# EAGLE design LPC_4TE_3.7_smd (EAGLE 5.03)
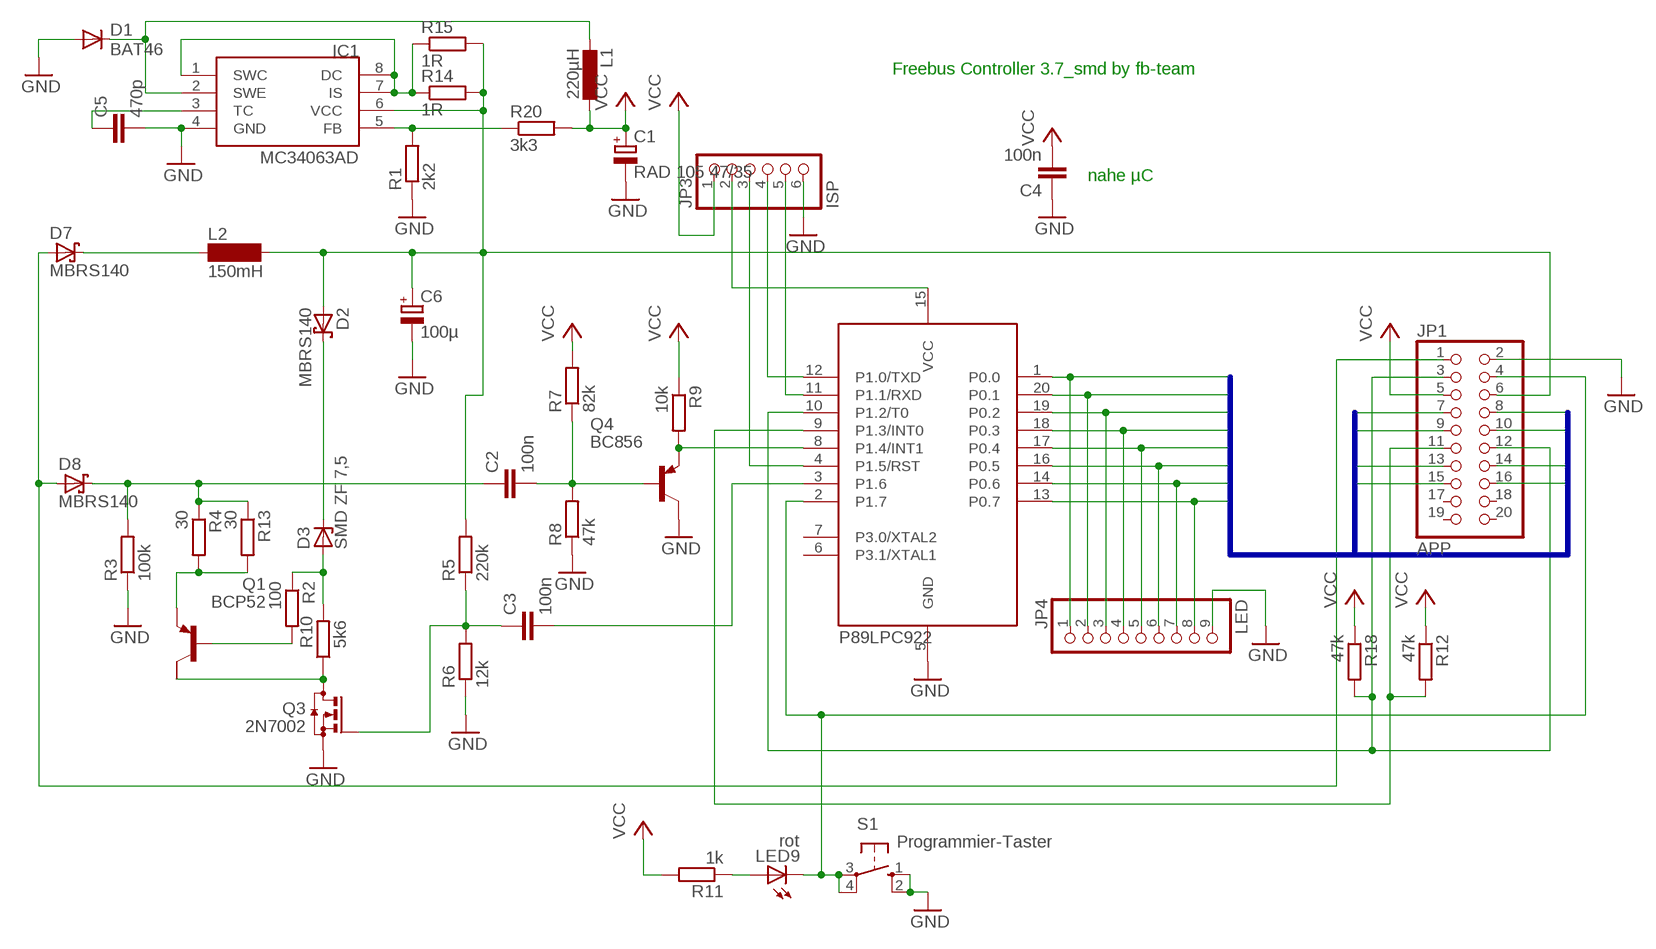
[diagram p0: schematic, sheet 1]

## Parts
C1  RAD 105 47/35  CPOL-EUE2-5  [E2-5]
C2  100n  C-EUC1206  [C1206]
C3  100n  C-EUC1206  [C1206]
C4  100n  C-EUC1206  [C1206]
C5  470p  C-EUC1206  [C1206]
C6  100µ  CPOL-EUE2.5-7  [E2,5-7]
D1  BAT46  DIODE-MINIMELF  [MINIMELF]
D2  MBRS140  MBRS130LT3  [SMB]
D3  SMD ZF 7,5  ZPD  [MINIMELF]
D7  MBRS140  MBRS130LT3  [SMB]
D8  MBRS140  MBRS130LT3  [SMB]
IC1  MC34063AD  [SOIC8]
JP1  APP  PINHD-2X10  [2X10]
JP3  ISP  PINHD-1X6  [1X06]
JP4  LED  PINHD-1X9  [1X09]
L1  220µH  L-EU2200-11.43  [2200-11.43]
L2  150mH  SD12-1000  [SD12_1000]
LED9  rot  LED3MM  [LED3MM]
Q1  BCP52  FZT753SMD  [SOT223]
Q3  2N7002  BSS123  [SOT23]
Q4  BC856  BC856ALT1SMD  [SOT23-BEC]
R1  2k2  R-EU_R1206  [R1206]
R2  100  R-EU_M1206  [M1206]
R3  100k  R-EU_M1206  [M1206]
R4  30  R-EU_R1206  [R1206]
R5  220k  R-EU_R1206  [R1206]
R6  12k  R-EU_M1206  [M1206]
R7  82k  R-EU_R1206  [R1206]
R8  47k  R-EU_M1206  [M1206]
R9  10k  R-EU_R1206  [R1206]
R10  5k6  R-EU_M1206  [M1206]
R11  1k  R-EU_M1206  [M1206]
R12  47k  R-EU_M1206  [M1206]
R13  30  R-EU_R1206  [R1206]
R14  1R  R-EU_M1206  [M1206]
R15  1R  R-EU_M1206  [M1206]
R18  47k  R-EU_M1206  [M1206]
R20  3k3  R-EU_M1206  [M1206]
S1  Programmier-Taster  10-XX  [B3F-10XX]
U$1  P89LPC922_SMD  [SO20W]

## Nets
GND: C1.- C4.1 C5.2 C6.- D1.A IC1.4(GND) JP1.2 JP3.6 JP4.9 Q3.2(S) Q4.C R1.1 R3.1 R6.1 R8.1 S1.1(S) S1.2(S1) U$1.5(GND)
N$1: Q4.E R9.2 U$1.8(P1.4/INT1)
N$2: C2.2 Q4.B R7.1 R8.2
N$3: IC1.5(FB) R1.2 R20.1
N$4: IC1.1(SWC) IC1.7(IS) IC1.8(DC) R14.1 R15.1
N$5: C3.2 U$1.3(P1.6)
N$6: Q1.2(C) Q3.3(D) R10.1
N$7: C6.+ D2.A IC1.6(VCC) JP1.6 L2.2 R5.2 R14.2 R15.2
N$8: D7.C L2.1
N$9: C2.1 D8.C R3.2 R4.1 R13.1
N$10: D1.C IC1.2(SWE) L1.2
N$11: D3.A R2.1 R10.2
N$12: Q1.3(E) R4.2 R13.2
N$13: C5.1 IC1.3(TC)
N$14: Q1.1(B) R2.2
N$16: D7.A D8.A JP1.1
N$17: JP1.4 LED9.K(C) S1.3(P) S1.4(P1) U$1.2(P1.7)
N$29: JP3.4 U$1.12(P1.0/TXD)
N$30: JP3.5 U$1.11(P1.1/RXD)
N$31: JP3.3 U$1.4(P1.5/RST)
N$32: JP3.2 U$1.15(VCC)
N$33: JP1.3 JP1.12 R18.2 U$1.10(P1.2/T0)
N$34: C3.1 Q3.1(G) R5.1 R6.2
N$40: D2.C D3.C
N$41: LED9.A R11.1
N$42: JP1.11 R12.2 U$1.9(P1.3/INT0)
P0.0: JP1.7 JP4.1 U$1.1(P0.0)
P0.1: JP1.8 JP4.2 U$1.20(P0.1)
P0.2: JP1.9 JP4.3 U$1.19(P0.2)
P0.3: JP1.10 JP4.4 U$1.18(P0.3)
P0.4: JP1.13 JP4.5 U$1.17(P0.4)
P0.5: JP1.14 JP4.6 U$1.16(P0.5)
P0.6: JP1.15 JP4.7 U$1.14(P0.6)
P0.7: JP1.16 JP4.8 U$1.13(P0.7)
VCC: C1.+ C4.2 JP1.5 JP3.1 L1.1 R7.2 R9.1 R11.2 R12.1 R18.1 R20.2
Unconnected: JP1.17 JP1.18 JP1.19 JP1.20 Q1.4(C/) U$1.6(P3.1/XTAL1) U$1.7(P3.0/XTAL2)

## Buses
P0.[0..7]

## Notes on the sheet
- Freebus Controller 3.7_smd by fb-team
- nahe µC
- P89LPC922

## Library data of the parts
C1 C6 = rcl:CPOL-EU: POLARIZED CAPACITOR, European symbol
C2-C5 = rcl:C-EU: CAPACITOR, European symbol
D1 = diode:DIODE-: DIODE
D2 D7 D8 = diode:MBRS130LT3: Schottky Power Rectifier Source: http://www.onsemi.com/pub/Collateral/MBRS130LT3-D.PDF
D3 = diode:ZPD: Z DIODE 500 mW
IC1 = mc34063:MC34063
JP1 = pinhead:PINHD-2X10: PIN HEADER
JP3 = pinhead:PINHD-1X6: PIN HEADER
JP4 = pinhead:PINHD-1X9: PIN HEADER
L1 = rcl:L-EU: INDUCTOR, European symbol
L2 = inductor-neosid:SD12: INDUCTOR nominal inductance
LED9 = led:LED: LED OSRAM: - CHIPLED LG R971, LG N971, LY N971, LG Q971, LY Q971, LO R971, LY R971 LH N974, LH R974 LS Q976, LO Q976, LY Q976 LO Q996 - Hyper CHIPLED LW Q18S LB Q993, LB Q99A, LB R99A - SideLED LS A670, LO A670, LY A670, LG A670, LP A670 LB A673, LV A673, LT A673, LW A673 LH A674 LY A675 LS A676, LA A676, LO A676, LY A676, LW A676 LS A679, LY A679, LG A679 - Hyper Micro SIDELED® LS Y876, LA Y876, LO Y876, LY Y876 LT Y87S - SmartLED LW L88C, LW L88S LB L89C, LB L89S, LG L890 LS L89K, LO L89K, LY L89K LS L896, LA L896, LO L896, LY L896 - TOPLED LS T670, LO T670, LY T670, LG T670, LP T670 LSG T670, LSP T670, LSY T670, LOP T670, LYG T670 LG T671, LOG T671, LSG T671 LB T673, LV T673, LT T673, LW T673 LH T674 LS T676, LA T676, LO T676, LY T676, LB T676, LH T676, LSB T676, LW T676 LB T67C, LV T67C, LT T67C, LS T67K, LO T67K, LY T67K, LW E67C LS E67B, LA E67B, LO E67B, LY E67B, LB E67C, LV E67C, LT E67C LW T67C LS T679, LY T679, LG T679 LS T770, LO T770, LY T770, LG T770, LP T770 LB T773, LV T773, LT T773, LW T773 LH T774 LS E675, LA E675, LY E675, LS T675 LS T776, LA T776, LO T776, LY T776, LB T776 LHGB T686 LT T68C, LB T68C - Hyper Mini TOPLED® LB M676 - Mini TOPLED Santana® LG M470 LS M47K, LO M47K, LY M47K Source: http://www.osram.convergy.de - LUMILED® LXK2-PW12-R00, LXK2-PW12-S00, LXK2-PW14-U00, LXK2-PW14-V00 LXK2-PM12-R00, LXK2-PM12-S00, LXK2-PM14-U00 LXK2-PE12-Q00, LXK2-PE12-R00, LXK2-PE12-S00, LXK2-PE14-T00, LXK2-PE14-U00 LXK2-PB12-K00, LXK2-PB12-L00, LXK2-PB12-M00, LXK2-PB14-N00, LXK2-PB14-P00, LXK2-PB14-Q00 LXK2-PR12-L00, LXK2-PR12-M00, LXK2-PR14-Q00, LXK2-PR14-R00 LXK2-PD12-Q00, LXK2-PD12-R00, LXK2-PD12-S00 LXK2-PH12-R00, LXK2-PH12-S00 LXK2-PL12-P00, LXK2-PL12-Q00, LXK2-PL12-R00 Source: www.luxeon.com
Q1 = transistor-pnp:FZT753SMD: PNP Transistor
Q3 = transistor-small-signal:BSS123: N-CHANNEL MOS FET
Q4 = transistor-pnp:BC856*: PNP Transistror
R1-R15 R18 R20 = rcl:R-EU_: RESISTOR, European symbol
S1 = switch-omron:10-XX: OMRON SWITCH
U$1 = micro-philips:P89LPC922_SMD

## Board
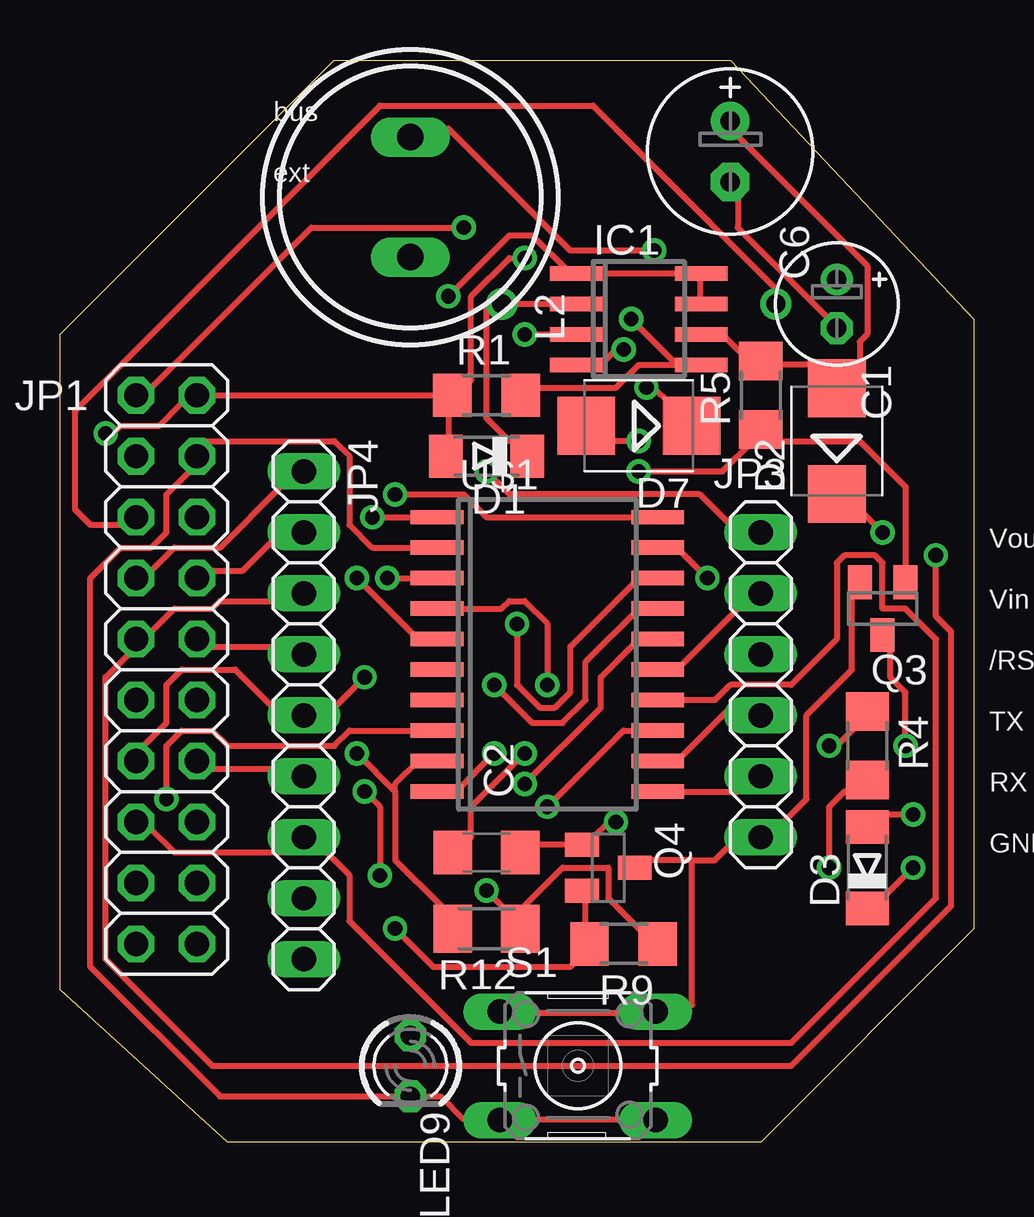
[diagram p1: board, top side]
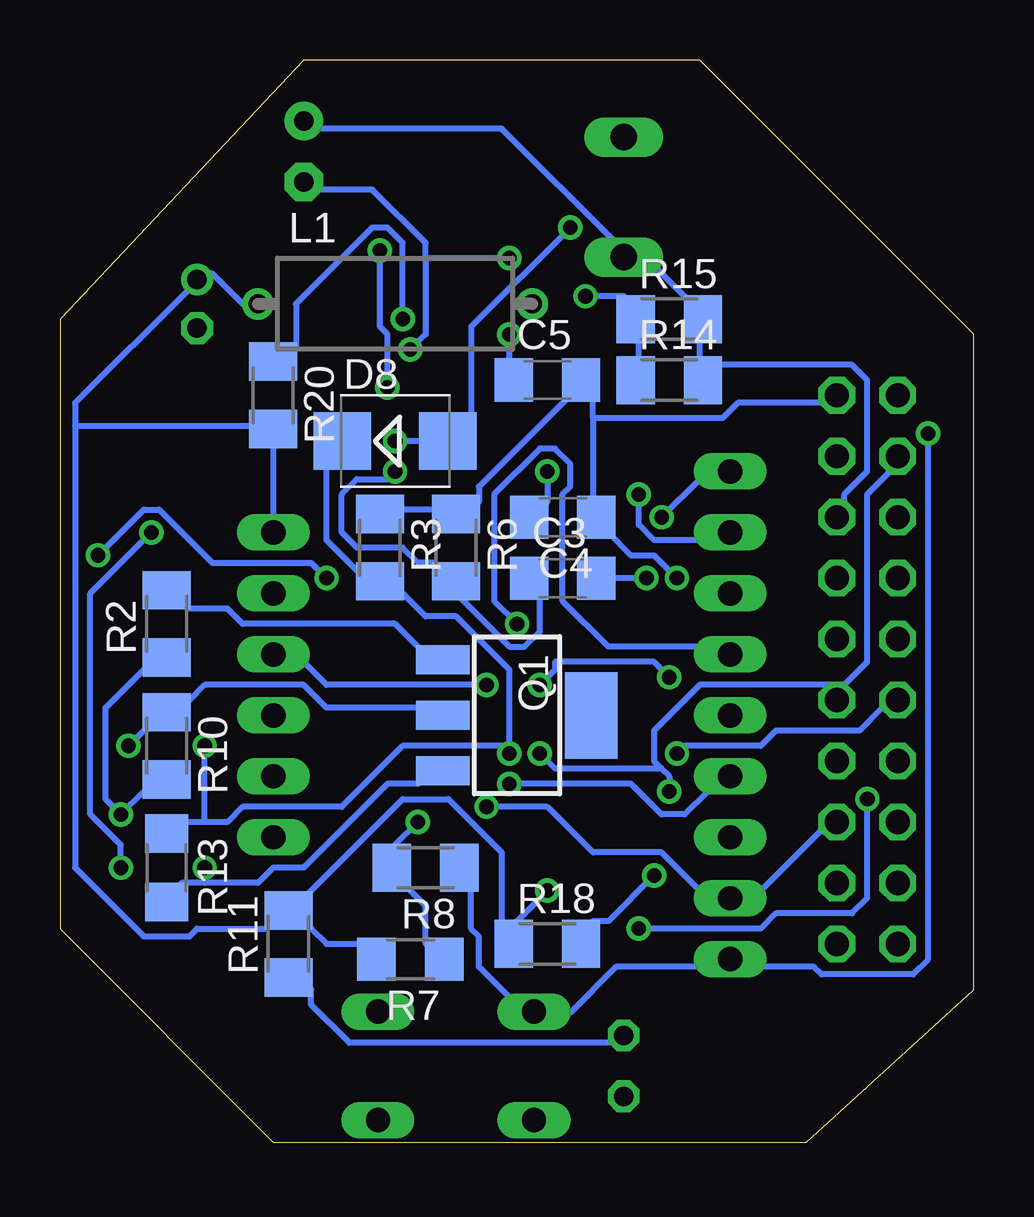
[diagram p2: board, bottom side, seen from below]

Size 38.1 x 45.09 mm. Coordinates in mm from the lower left corner, seen from the top.
Outline: 0,6.35 0,33.66 11.43,45.09 27.94,45.09 38.1,34.29 38.1,8.89 29.21,0 6.98,0 0,6.35
Copper layers (1*16): Top 0.035mm / dielectric 1.5mm / Bottom 0.035mm
Design rules "default *": minimum track width 10mil, minimum drill 24mil, track to track 10mil, track to pad 10mil, pad to pad 10mil, via to via 10mil, smd to smd 8mil, copper to edge 20mil, drill to drill 8mil, minimum pad ring 10mil, minimum via ring 8mil, stop-mask expansion 4mil, vias tented up to drill 0mil, thermal gap 10mil

### Footprints (pad centres in the part's own frame; a part is rotated, then mirrored left to right if it is on the bottom)
E2-5 = drill 0.813 pad 1.27 round: + -1.016,0 | drill 0.813 pad 1.27 octagon: - 1.016,0
C1206 = smd 1.6 x 1.8: 1 -1.4,0; 2 1.4,0
E2,5-7 = drill 0.813 pad 1.6 round: + -1.27,0 | drill 0.813 pad 1.6 octagon: - 1.27,0
MINIMELF = smd 1.4 x 1.8: A 1.7,0; C -1.7,0
SMB = smd 2.4 x 2.4: A 2.2,0; C -2.2,0
SOIC8 = smd 0.6 x 2.2: 1 -1.905,-2.6; 2 -0.635,-2.6; 3 0.635,-2.6; 4 1.905,-2.6; 5 1.905,2.6; 6 0.635,2.6; 7 -0.635,2.6; 8 -1.905,2.6
2X10 = drill 1.016 octagon: 1 -11.43,-1.27; 2 -11.43,1.27; 3 -8.89,-1.27; 4 -8.89,1.27; 5 -6.35,-1.27; 6 -6.35,1.27; 7 -3.81,-1.27; 8 -3.81,1.27; 9 -1.27,-1.27; 10 -1.27,1.27; 11 1.27,-1.27; 12 1.27,1.27; 13 3.81,-1.27; 14 3.81,1.27; 15 6.35,-1.27; 16 6.35,1.27; 17 8.89,-1.27; 18 8.89,1.27; 19 11.43,-1.27; 20 11.43,1.27
1X06 = drill 1.016 long: 1 -6.35,0; 2 -3.81,0; 3 -1.27,0; 4 1.27,0; 5 3.81,0; 6 6.35,0
1X09 = drill 1.016 long: 1 -10.16,0; 2 -7.62,0; 3 -5.08,0; 4 -2.54,0; 5 0,0; 6 2.54,0; 7 5.08,0; 8 7.62,0; 9 10.16,0
2200-11.43 = drill 0.8 pad 1.27 round: 1 -5.715,0; 2 5.715,0
SD12_1000 = drill 1.1 long: 1 -2.5,0; 2 2.5,0
LED3MM = drill 0.813 octagon: A -1.27,0; K 1.27,0
SOT223 = smd 1.219 x 2.235: 1 -2.311,-3.099; 2 0,-3.099; 3 2.311,-3.099 | smd 3.6 x 2.2: 4 0,3.099
SOT23 = smd 1 x 1.4: 1 -0.95,-1.1; 2 0.95,-1.1; 3 0,1.1
SOT23-BEC = smd 1 x 1.4: B -0.95,-1.1; C 0,1.1; E 0.95,-1.1
R1206 = smd 1.6 x 1.803: 1 -1.422,0; 2 1.422,0
M1206 = smd 1.6 x 2: 1 -1.4,0; 2 1.4,0
B3F-10XX = drill 1.016 long: 1 -3.251,2.261; 2 3.251,2.261; 3 -3.251,-2.261; 4 3.251,-2.261
SO20W = smd 0.6 x 2.2: 1 -5.715,-4.6; 2 -4.445,-4.6; 3 -3.175,-4.6; 4 -1.905,-4.6; 5 -0.635,-4.6; 6 0.635,-4.6; 7 1.905,-4.6; 8 3.175,-4.6; 9 4.445,-4.6; 10 5.715,-4.6; 11 5.715,4.6; 12 4.445,4.6; 13 3.175,4.6; 14 1.905,4.6; 15 0.635,4.6; 16 -0.635,4.6; 17 -1.905,4.6; 18 -3.175,4.6; 19 -4.445,4.6; 20 -5.715,4.6

### Placement (x,y rotation side)
C1  32.39,34.92 270 top
C2  17.78,12.07 0 top
C3  17.14,23.5 0 bottom
C4  17.14,26.04 180 bottom
C5  17.78,31.75 0 bottom
C6  27.94,41.27 270 top
D1  17.78,28.58 180 top
D2  32.39,29.21 90 top
D3  33.66,11.43 90 top
D7  24.13,29.84 180 top
D8  24.13,29.21 0 bottom
IC1  24.13,34.29 270 top
JP1  4.45,19.69 270 top
JP3  29.21,19.05 270 top
JP4  10.16,17.78 270 top
L1  24.13,34.92 0 bottom
L2  14.61,39.37 270 top
LED9  14.61,3.17 270 top
Q1  19.05,17.78 270 bottom
Q3  34.29,22.23 180 top
Q4  22.86,11.43 270 top
R1  17.78,31.12 0 top
R2  33.66,21.59 90 bottom
R3  24.77,24.77 270 bottom
R4  33.66,16.51 270 top
R5  29.21,31.12 90 top
R6  21.59,24.77 270 bottom
R7  23.5,7.62 180 bottom
R8  22.86,11.43 180 bottom
R9  23.5,8.25 180 top
R10  33.66,16.51 270 bottom
R11  28.57,8.25 90 bottom
R12  17.78,8.89 180 top
R13  33.66,11.43 270 bottom
R14  12.7,31.75 0 bottom
R15  12.7,34.29 0 bottom
R18  17.78,8.25 0 bottom
R20  29.21,31.12 270 bottom
S1  21.59,3.17 0 top
U$1  20.32,20.32 270 top

### Tracks (layer width: path | path; a pad name or v marks a point on that pad's centre or on a via)
GND  (via drill 0.61)
  Top 0.254: 26.35,11.75 27.31,11.75 27.94,12.38 JP3.6 30.16,13.34 31.11,14.29 31.11,17.78 33.02,19.69 33.02,22.86 Q3.2 | 26.35,11.75 24.45,11.75 Q4.C | S1.1 19.68,5.4 23.5,5.4 S1.2 26.35,5.71 26.35,11.75 | v23.5,33.02 23.18,33.02 22.54,32.38 IC1.4 | C1.- 32.07,34.29 28.26,38.1 28.26,39.37 C6.- | D1.A 16.19,29.21 16.19,30.48 R1.1 | R1.1 JP1.2 5.08,30.8 4.13,29.84 2.54,29.84 2.22,29.53 v1.91,29.53 | v12.38,23.5 14.92,20.96 U$1.5 | v19.37,36.83 18.73,36.83 17.14,35.24 17.14,31.75 R1.1
  Bottom 0.254: R8.1 20.96,10.48 20.96,8.89 20.64,8.57 20.64,7.3 19.37,6.03 S1.1 16.83,5.4 14.92,7.3 11.43,7.3 JP4.9 8.89,7.3 6.67,7.3 6.35,6.99 2.54,6.99 1.91,7.62 v1.91,29.53 | v23.5,33.02 22.86,33.66 22.86,36.83 | 22.86,36.83 22.86,37.47 25.08,39.69 27.31,39.69 C6.- | R3.1 23.81,26.35 22.54,26.35 R6.1 20.64,26.67 20.64,27.3 16.83,31.12 C5.2 15.88,31.12 15.88,30.16 | 15.88,30.16 15.88,26.67 C4.1 15.24,25.4 14.29,24.45 13.34,24.45 v12.38,23.5 | 15.88,30.16 10.48,30.16 9.84,30.8 6.35,30.8 JP1.2 | v19.37,36.83 22.86,36.83
N$1  (via drill 0.61)
  Top 0.254: Q4.E 21.91,10.16 21.91,8.89 R9.2 21.59,7.62 21.27,7.3 15.56,7.3 v13.97,8.89 | v4.45,14.29 4.45,16.51 5.08,17.14 6.35,17.14 6.98,16.51 11.43,16.51 12.07,17.14 U$1.8
  Bottom 0.254: v4.45,14.29 4.45,10.16 5.08,9.53 8.26,9.53 8.89,8.89 v13.97,8.89
N$2  (via drill 0.61)
  Top 0.254: C2.2 19.68,12.38 21.27,12.38 Q4.B 22.23,12.7 22.86,13.34 v23.18,13.34
  Bottom 0.254: R7.1 22.86,8.25 22.86,9.84 23.5,10.48 R8.2 24.13,12.38 v23.18,13.34
N$3  (via drill 0.61)
  Top 0.254: 25.72,32.38 24.13,32.38 23.18,31.43 19.68,31.43 R1.2 | 25.72,32.38 v23.81,34.29 | 25.72,32.38 IC1.5
  Bottom 0.254: v23.81,34.29 23.81,37.47 24.45,38.1 25.08,38.1 28.26,34.92 28.26,33.02 R20.1
N$4  (via drill 0.61)
  Top 0.254: IC1.7 26.67,34.92 26.67,36.2 IC1.8 IC1.1 21.27,36.2 19.68,37.78 18.73,37.78 v16.19,35.24
  Bottom 0.254: R14.1 13.97,32.7 13.97,33.34 R15.1 14.61,35.24 v16.19,35.24
N$5  (via drill 0.61)
  Top 0.254: v13.65,23.5 U$1.3
  Bottom 0.254: v13.65,23.5 C3.2
N$6  (via drill 0.61)
  Top 0.254: v35.24,16.51 35.24,18.73 34.61,19.37 34.61,20.64 Q3.3
  Bottom 0.254: v35.24,16.51 34.61,17.14 R10.1 32.7,18.41 32.07,19.05 27.94,19.05 26.99,18.1 23.18,18.1 Q1.2
N$7
  Top 0.254: IC1.6 27.62,33.66 28.57,32.7 R5.2 29.85,32.38 31.43,32.38 D2.A 33.34,32.38 33.34,33.34 33.66,33.66 33.66,36.51 28.26,41.91 C6.+
  Bottom 0.254: JP1.6 5.4,26.67 5.4,26.99 4.45,27.94 4.45,31.75 5.08,32.38 10.8,32.38 R14.2 11.43,32.7 11.43,33.34 R15.2 12.07,35.24 13.34,36.51 L2.2 14.92,37.47 19.68,42.23 27.31,42.23 C6.+
N$8  (via drill 0.61)
  Top 0.254: v24.45,31.43 24.77,31.43 25.4,30.8 D7.C | v24.77,37.15 21.27,37.15 16.19,42.23 L2.1
  Bottom 0.254: v24.45,31.43 24.45,33.66 24.77,33.97 v24.77,37.15
N$9  (via drill 0.61)
  Top 0.254: v19.37,16.19 17.14,13.97 17.14,12.7 C2.1 | v32.07,16.51 32.39,16.51 33.02,17.14 R4.1
  Bottom 0.254: 32.07,13.34 31.11,13.34 30.48,13.97 26.35,13.97 23.81,16.51 19.68,16.51 v19.37,16.19 19.37,19.69 21.59,21.91 22.86,21.91 23.81,22.86 R3.2 25.72,23.81 26.99,25.08 26.99,28.26 D8.C | 32.07,13.34 33.02,13.34 R13.1 | 32.07,13.34 v32.07,16.51
N$10
  Top 0.254: D1.C 19.05,29.21 18.73,29.21 17.78,30.16 17.78,34.92 L1.2 IC1.2
N$11  (via drill 0.61)
  Top 0.254: v35.56,13.65 34.29,13.65 D3.A
  Bottom 0.254: R10.2 34.61,14.61 v35.56,13.65 36.19,14.29 36.19,18.1 34.61,19.69 R2.1
N$12  (via drill 0.61)
  Top 0.254: v32.07,11.43 32.07,13.97 32.7,14.61 33.02,14.61 R4.2
  Bottom 0.254: 32.07,10.8 29.85,10.8 29.21,11.43 27.94,11.43 24.45,14.92 23.18,14.92 Q1.3 | 32.07,10.8 33.02,10.8 R13.2 | 32.07,10.8 v32.07,11.43
N$13  (via drill 0.61)
  Top 0.254: v19.37,33.66 IC1.3
  Bottom 0.254: v19.37,33.66 19.37,32.38 C5.1
N$14
  Bottom 0.254: R2.2 32.7,22.23 31.11,22.23 30.48,21.59 24.13,21.59 23.18,20.64 Q1.1
N$16  (via drill 0.61)
  Top 0.254: v24.13,29.21 22.86,29.21 D7.A | v16.83,38.1 10.48,38.1 3.81,31.43 JP1.1
  Bottom 0.254: v24.13,29.21 D8.A 20.96,30.16 20.96,33.97 v16.83,38.1
N$17
  Top 0.254: S1.4 23.5,0.95 19.68,0.95 S1.3 16.83,0.95 15.88,1.91 LED9.K 6.67,1.91 1.27,7.3 1.27,23.5 2.54,24.77 3.81,24.77 4.45,25.4 4.45,26.99 5.4,27.94 JP1.4 6.03,29.21 11.43,29.21 12.07,28.58 12.07,25.72 13.02,24.77 U$1.2
N$29
  Top 0.254: U$1.12 25.72,15.88 27.94,18.1 JP3.4
N$30
  Top 0.254: U$1.11 28.26,14.61 JP3.5
N$31  (via drill 0.61)
  Top 0.254: v20.32,19.05 20.32,21.59 19.37,22.54 18.73,22.54 18.41,22.23 U$1.4
  Bottom 0.254: v20.32,19.05 26.99,19.05 27.94,20 JP3.3
N$32
  Top 0.254: U$1.15 25.72,19.69 28.26,22.23 JP3.2
N$33  (via drill 0.61)
  Top 0.254: v13.34,11.11 13.34,13.97 v12.7,14.61 | v18.1,16.19 16.51,14.61 U$1.10
  Bottom 0.254: v13.34,11.11 15.24,9.21 15.88,9.21 R18.2 | v12.7,14.61 12.7,15.24 13.02,15.56 | 13.02,15.56 13.34,15.88 13.34,17.14 11.43,19.05 6.03,19.05 JP1.12 5.4,19.05 4.45,20 4.45,26.99 3.49,27.94 JP1.3 | v18.1,16.19 17.46,15.56 13.02,15.56
N$34  (via drill 0.61)
  Top 0.254: Q3.1 35.24,23.81 35.24,27.3 33.34,29.21 29.85,29.21 R5.1 28.89,29.21 27.62,27.94 v24.13,27.94
  Bottom 0.254: C3.1 18.1,22.86 18.1,21.27 18.73,20.64 19.37,20.64 21.59,22.86 R6.2 22.54,24.13 23.18,24.13 23.81,24.77 25.72,24.77 26.35,25.4 26.35,26.99 25.72,27.62 24.45,27.62 v24.13,27.94
N$40  (via drill 0.61)
  Top 0.254: v35.56,11.43 34.29,10.16 D3.C | v34.29,25.4 33.34,26.35 D2.C
  Bottom 0.254: v35.56,11.43 35.56,12.38 36.83,13.65 36.83,22.86 v34.29,25.4
N$41
  Bottom 0.254: R11.1 27.62,6.35 27.62,5.71 26.04,4.13 14.92,4.13 LED9.A
N$42  (via drill 0.61)
  Top 0.254: 13.97,14.61 13.97,14.92 14.92,15.88 U$1.9 | 13.97,14.61 13.97,11.75 15.88,9.84 R12.2 | v12.38,16.19 13.97,14.61
  Bottom 0.254: v12.38,16.19 12.07,16.51 8.89,16.51 8.26,17.14 4.76,17.14 3.81,18.1 JP1.11
P0.0  (via drill 0.61)
  Top 0.254: v13.02,26.04 U$1.1 | JP1.7 3.81,23.81 4.76,24.77 6.67,24.77 9.21,27.3 JP4.1
  Bottom 0.254: v13.02,26.04 11.43,27.62 JP4.1
P0.1  (via drill 0.61)
  Top 0.254: v13.97,26.99 16.83,26.99 17.78,26.04 U$1.20 | JP1.8 6.35,23.81 7.62,23.81 8.89,25.08 JP4.2
  Bottom 0.254: v13.97,26.99 13.97,25.72 13.34,25.08 11.43,25.08 JP4.2
P0.2  (via drill 0.61)
  Top 0.254: v26.99,23.5 25.72,24.77 U$1.19 | v36.51,24.45 36.51,21.91 37.15,21.27 37.15,9.84 30.48,3.17 6.35,3.17 1.91,7.62 1.91,19.37 2.86,20.32 JP1.9 3.81,21.27 4.76,22.23 6.35,22.23 6.67,22.54 8.89,22.54 JP4.3
  Bottom 0.254: v26.99,23.5 27.62,24.13 31.75,24.13 33.97,26.35 34.61,26.35 v36.51,24.45
P0.3  (via drill 0.61)
  Top 0.254: v19.05,21.59 19.05,19.05 20,18.1 20.64,18.1 21.27,18.73 21.27,20.64 24.13,23.5 U$1.18 | JP1.10 6.35,20.64 8.89,20.64 JP4.4
  Bottom 0.254: v19.05,21.59 20,22.54 20,26.99 18.1,28.89 17.46,28.89 16.83,28.26 16.83,27.3 17.14,26.99 17.14,22.54 15.24,20.64 11.43,20.64 JP4.4
P0.4  (via drill 0.61)
  Top 0.254: v18.1,19.05 19.68,17.46 20.96,17.46 21.91,18.41 21.91,20 24.13,22.23 U$1.17 | v12.7,19.37 11.43,18.1 JP4.5 8.89,18.1 7.3,19.69 5.08,19.69 4.45,19.05 4.45,17.46 3.49,16.51 JP1.13
  Bottom 0.254: v18.1,19.05 17.46,19.69 17.46,20 13.34,20 v12.7,19.37
P0.5  (via drill 0.61)
  Top 0.254: v19.37,14.92 22.54,18.1 22.54,19.37 24.13,20.96 U$1.16 | JP1.14 6.35,15.56 8.89,15.56 JP4.6
  Bottom 0.254: v19.37,14.92 14.29,14.92 13.02,13.65 12.07,13.65 11.11,14.61 JP4.6
P0.6
  Top 0.254: U$1.14 27.31,18.41 27.94,19.05 30.48,19.05 32.39,20.96 32.39,24.13 32.7,24.45 33.97,24.45 34.29,24.13 34.29,22.23 35.24,22.23 36.51,20.96 36.51,10.16 30.48,4.13 17.14,4.13 12.07,9.21 12.07,11.11 11.11,12.07 JP4.7 9.21,12.07 4.76,12.07 3.81,13.02 JP1.15
P0.7  (via drill 0.61)
  Top 0.254: v20.32,13.97 23.5,17.14 U$1.13
  Bottom 0.254: v20.32,13.97 17.78,13.97 15.88,12.07 13.02,12.07 11.43,10.48 JP4.8 8.89,10.48 6.35,13.02 JP1.16
VCC  (via drill 0.61)
  Top 0.254: v17.78,27.94 18.73,26.99 26.67,26.99 27.94,25.72 JP3.1 | R9.1 24.13,8.89 22.86,10.16 22.86,11.43 20.96,11.43 19.37,9.84 R12.1 18.41,9.84 v17.78,10.48 | JP1.5 2.54,25.72 1.27,25.72 0.63,26.35 0.63,30.48 13.34,43.18 22.23,43.18 29.85,35.56 L1.1
  Bottom 0.254: v17.78,27.94 17.78,26.67 C4.2 | JP3.1 R20.2 30.16,29.84 37.47,29.84 | R7.2 25.4,8.25 26.99,8.25 27.62,8.89 R11.2 | R11.2 27.94,10.16 23.81,14.29 21.91,14.29 19.68,12.07 19.68,9.21 R18.1 19.05,9.21 v17.78,10.48 | L1.1 30.48,34.92 31.75,36.2 C1.+ 32.7,35.56 37.47,30.8 37.47,29.84 | 37.47,29.84 37.47,11.43 34.61,8.57 32.7,8.57 32.39,8.89 29.53,8.89 R11.2

### Text on the board
tPlace: bus | ext | Vout | Vin | /RST | TX | RX | GND